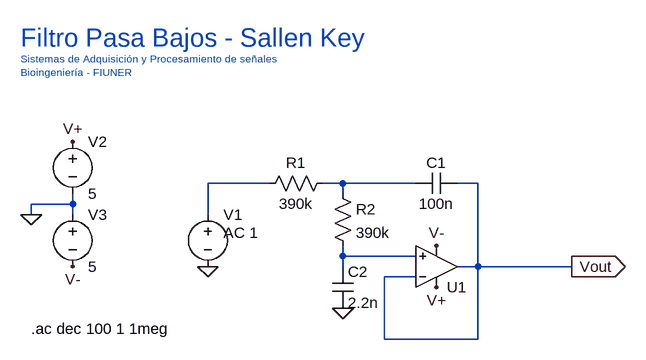
[diagram p0: schematic Analisis_Frecuencial_SallenKey_SECCION1.asc]
Analisis_Frecuencial_SallenKey_SECCION1.asc, the LTspice schematic file:
Version 4
SHEET 1 880 680
WIRE -80 -448 -176 -448
WIRE 32 -448 0 -448
WIRE 144 -448 32 -448
WIRE 240 -448 208 -448
WIRE 32 -432 32 -448
WIRE -384 -416 -384 -432
WIRE -384 -416 -448 -416
WIRE -448 -400 -448 -416
WIRE -384 -400 -384 -416
WIRE -176 -400 -176 -448
WIRE 32 -336 32 -352
WIRE 144 -336 32 -336
WIRE 32 -320 32 -336
WIRE 240 -320 240 -448
WIRE 240 -320 208 -320
WIRE 384 -320 240 -320
WIRE 144 -304 96 -304
WIRE 96 -208 96 -304
WIRE 240 -208 240 -320
WIRE 240 -208 96 -208
FLAG 176 -288 V+
FLAG 176 -352 V-
FLAG 32 -256 0
FLAG -176 -320 0
FLAG -448 -400 0
FLAG -384 -320 V-
FLAG -384 -512 V+
FLAG 384 -320 Vout
IOPIN 384 -320 Out
SYMBOL Opamps\\UniversalOpamp2 176 -320 M180
SYMATTR InstName U1
SYMBOL res 16 -464 R90
WINDOW 0 0 56 VBottom 2
WINDOW 3 32 56 VTop 2
SYMATTR InstName R1
SYMATTR Value 390k
SYMBOL res 16 -448 R0
SYMATTR InstName R2
SYMATTR Value 390k
SYMBOL cap 208 -464 R90
WINDOW 0 0 32 VBottom 2
WINDOW 3 32 32 VTop 2
SYMATTR InstName C1
SYMATTR Value 100n
SYMBOL cap 16 -320 R0
SYMATTR InstName C2
SYMATTR Value 2.2n
SYMBOL voltage -176 -416 R0
WINDOW 123 24 44 Left 2
WINDOW 39 0 0 Left 2
SYMATTR Value2 AC 1
SYMATTR InstName V1
SYMATTR Value ""
SYMBOL voltage -384 -528 R0
WINDOW 123 0 0 Left 2
WINDOW 39 0 0 Left 2
SYMATTR InstName V2
SYMATTR Value 5
SYMBOL voltage -384 -416 R0
WINDOW 123 0 0 Left 2
WINDOW 39 0 0 Left 2
SYMATTR InstName V3
SYMATTR Value 5
TEXT -448 -224 Left 2 !.ac dec 100 1 1meg
TEXT -464 -672 Left 4 ;Filtro Pasa Bajos - Sallen Key
TEXT -464 -640 Left 1 ;Sistemas de Adquisición y Procesamiento de señales\nBioingeniería - FIUNER

The netlist it stands for:
* Analisis_Frecuencial_SallenKey_SECCION1.asc
XU1 N003 Vout V+ V- Vout level.2 Avol=1Meg GBW=10Meg Slew=10Meg ilimit=25m rail=0 Vos=0 phimargin=45 en=0 enk=0 in=0 ink=0 Rin=500Meg  ; pins IN+ IN- V+ V- OUT
R1 N002 N001 390k
R2 N002 N003 390k
C1 Vout N002 100n
C2 N003 0 2.2n
V1 N001 0 AC 1
V2 V+ 0 5
V3 0 V- 5
.ac dec 100 1 1meg
* Filtro Pasa Bajos - Sallen Key
* Sistemas de Adquisición y Procesamiento de señales
* Bioingeniería - FIUNER
.lib UniversalOpamps2.sub
.backanno
.end